# Altium schematic sheet Connector.SchDoc
size A4; Organization: Altium Limited; Address1: L3, 12a Rodborough Rd; Address2: Frenchs Forest; Address3: NSW; Address4: Australia 2086
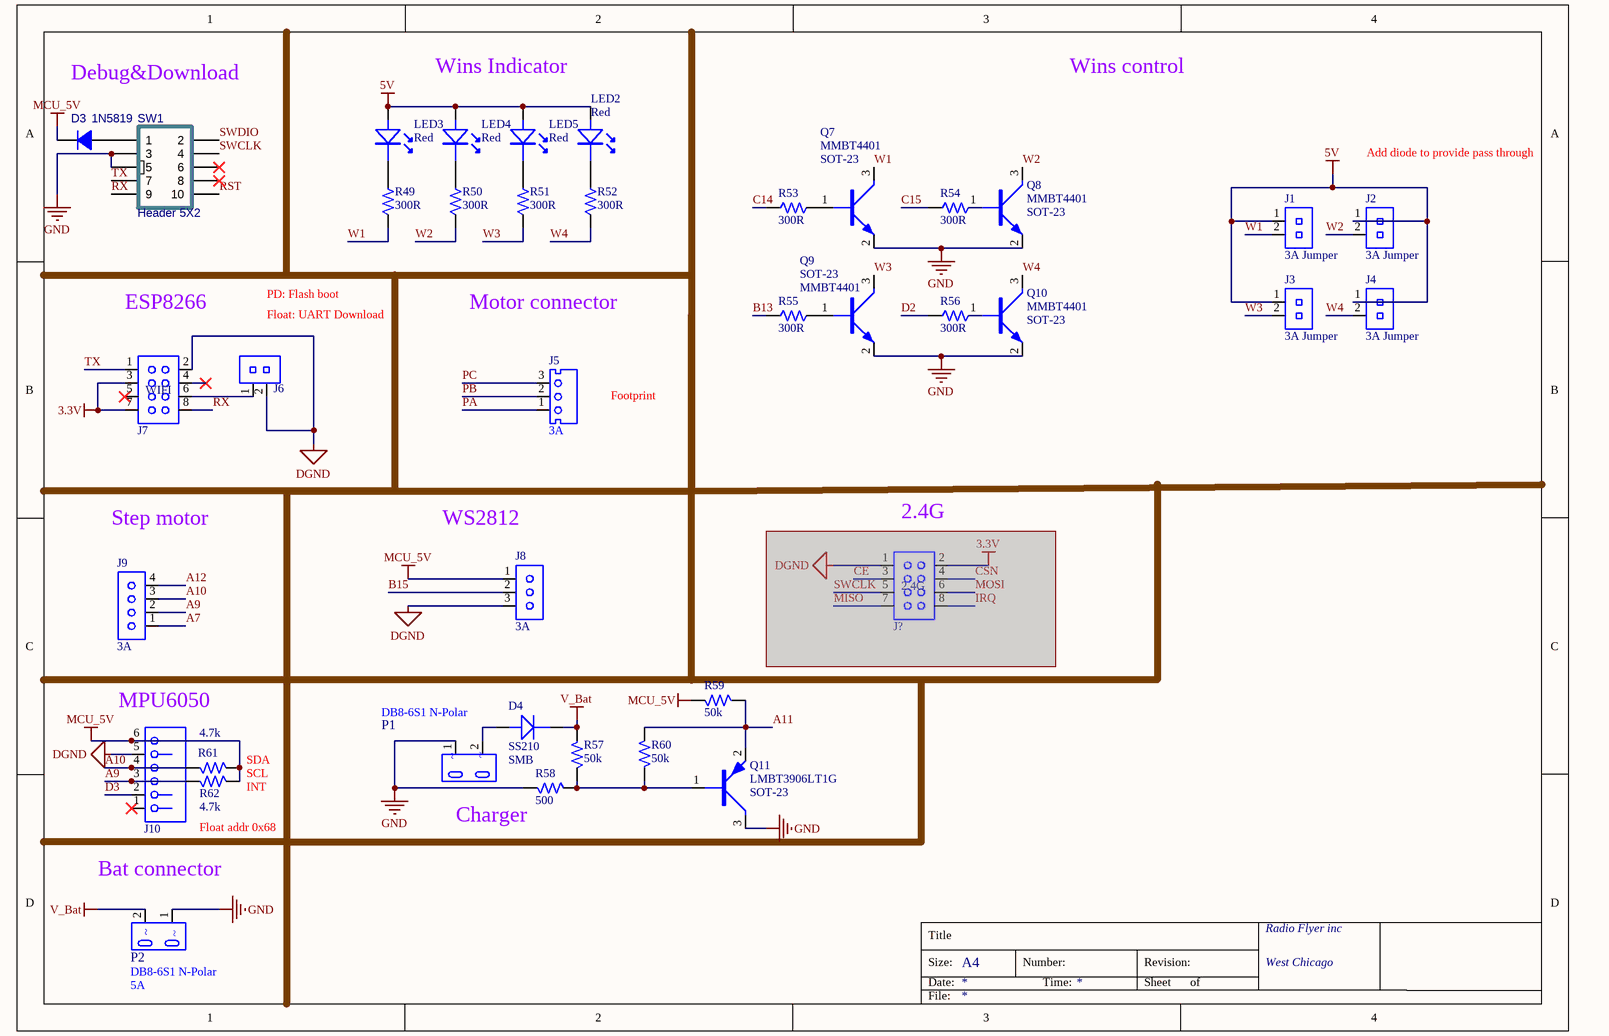
[diagram p0: Connector.SchDoc]

## Parts
D3  1N5819  [SOD-123-L]
D4  RCD102100-0110  [SMB]  (value not drawn)
J1  Current: 3A Jumper  [HOUSING 2P PH=2.54mm Jumper]  (hidden comment: CCH254020-0102)
J2  Current: 3A Jumper  [HOUSING 2P PH=2.54mm Jumper]  (hidden comment: CCH254020-0102)
J3  Current: 3A Jumper  [HOUSING 2P PH=2.54mm Jumper]  (hidden comment: CCH254020-0102)
J4  Current: 3A Jumper  [HOUSING 2P PH=2.54mm Jumper]  (hidden comment: CCH254020-0102)
J5  Current: 3A  [CONN 3P PH=2.5mm B3B-XH-A]  (hidden comment: CCN250000-0103)
J6  CCH254020-0102  [HOUSING 2P PH=2.54mm Jumper]  (value not drawn)
J7  WIFI  [HEAD 8P 2X4 PH=2.54mm 90 H5mm_2.54-2X4AW-10.4]
J8  Current: 3A  [HEAD 3P PH=2.54mm 180]  (hidden comment: CCP254010-0103)
J9  Current: 3A  [HEAD 4P PH=2.54mm 180]  (hidden comment: CCP254260-0104)
J10  T690300121600  [CONN 6P PH=2.5mm RA XHB-6AW-KL]  (value not drawn)
J?  2.4G  [HEAD 8P 2X4 PH=2.54mm 90 H5mm_2.54-2X4AW-10.4]  (masked out: inside a compile mask, not in the netlist)
LED2  Color: Red  [3mm LED-R]  (hidden comment: KED200001-0010)
LED3  Color: Red  [3mm LED-R]  (hidden comment: KED200001-0010)
LED4  Color: Red  [3mm LED-R]  (hidden comment: KED200001-0010)
LED5  Color: Red  [3mm LED-R]  (hidden comment: KED200001-0010)
P1  MFG Part: DB8-6S1 N-Polar  [AC INLET 2P DB8-6S1]  (hidden comment: CJP012009-0050)
P2  MFG Part: DB8-6S1 N-Polar  Current: 5A  [Motor connector]  (hidden comment: CJP012009-0050)
Q7  Package: SOT-23  [SOT23-132-RW]  (hidden comment: MMBT4401)
Q8  Package: SOT-23  [SOT23-132-RW]  (hidden comment: MMBT4401)
Q9  Package: SOT-23  [SOT23-132-RW]  (hidden comment: MMBT4401)
Q10  Package: SOT-23  [SOT23-132-RW]  (hidden comment: MMBT4401)
Q11  MFG Part: LMBT3906LT1G  Package: SOT-23  [SOT23-132-RW]  (hidden comment: RCP003906-0002)
R49  value 300R  [0603]  (hidden comment: T5024421083A9)
R50  value 300R  [0603]  (hidden comment: T5024421083A9)
R51  value 300R  [0603]  (hidden comment: T5024421083A9)
R52  value 300R  [0603]  (hidden comment: T5024421083A9)
R53  value 300R  [0603]  (hidden comment: T5024421083A9)
R54  value 300R  [0603]  (hidden comment: T5024421083A9)
R55  value 300R  [0603]  (hidden comment: T5024421083A9)
R56  value 300R  [0603]  (hidden comment: T5024421083A9)
R57  value 50k  [0603]  (hidden comment: T5024421083A9)
R58  value 500  [0603]  (hidden comment: T5024421083A9)
R59  value 50k  [0603]  (hidden comment: T5024421083A9)
R60  value 50k  [0603]  (hidden comment: T5024421083A9)
R61  value 4.7k  [0603]  (hidden comment: T5024421083A9)
R62  value 4.7k  [0603]  (hidden comment: T5024421083A9)
SW1  Header 5X2  [HDR2X5]

## Nets
3.3V: J7.3 J7.7
5V: J1.1 J2.1 J3.1 J4.1 LED2.1(A) LED3.1(A) LED4.1(A) LED5.1(A)
DGND: J6.2 J7.2 J8.3 J10.5
GND: P1.1 P2.1 Q7.2(E) Q8.2(E) Q9.2(E) Q10.2(E) Q11.3(C) R58.1 SW1.3 SW1.5
MCU_5V: D3.K J8.1 J10.6 R59.2 R61.2 R62.2
V_Bat: D4.2(K) P2.2 R57.1
A7: J9.1
A9: J9.2 J10.3 R62.1
A10: J9.3 J10.4 R61.1
A11: Q11.2(E) R59.1 R60.2
A12: J9.4
B13: R55.1
B15: J8.2
C14: R53.1
C15: R54.1
D2: R56.1
D3: J10.2
PA: J5.1
PB: J5.2
PC: J5.3
RST: SW1.10
RX: J7.8 SW1.9
SWCLK: SW1.4
SWDIO: SW1.2
TX: J7.1 SW1.7
W1: J1.2 Q7.3(C) R49.2
W2: J2.2 Q8.3(C) R50.2
W3: J3.2 Q9.3(C) R51.2
W4: J4.2 Q10.3(C) R52.2
NetD3_A: D3.A SW1.1
NetD4_1: D4.1(A) P1.2
NetJ6_1: J6.1 J7.6
NetLED2_2: LED2.2(K) R52.1
NetLED3_2: LED3.2(K) R49.1
NetLED4_2: LED4.2(K) R50.1
NetLED5_2: LED5.2(K) R51.1
NetQ7_1: Q7.1(B) R53.2
NetQ8_1: Q8.1(B) R54.2
NetQ9_1: Q9.1(B) R55.2
NetQ10_1: Q10.1(B) R56.2
NetQ11_1: Q11.1(B) R57.2 R58.2 R60.1

Not connected (* = marked no-connect by the designer): J7 4* 5*; J10 1*; SW1 6* 8*

## Notes on the sheet
- Debug&Download
- Wins Indicator
- Wins control
- Add diode to provide pass through
- ESP8266
- PD: Flash boot
- Motor connector
- Float: UART Download
- Footprint
- (near J?) 2.4G
- Step motor
- (near J8) WS2812
- (near J10) MPU6050
- SDA
- SCL
- INT
- Float addr 0x68
- (near R58) Charger
- Bat connector
- Title
- Size:
- Date:
- A4
- Number:
- Time:
- Revision:
- Sheet
- of
- Radio Flyer inc
- West Chicago
- File:
- (in symbol AC INLET 2P DB8-6S1 N-Polar) ~

## Library data of the parts
D3 = Diode: 普通二极管 Diode; Imax: 500mA; Published: 8-Jun-2000; Revision: July-2002: Re-released for DXP Platform.; Publisher: Altium Limited; Price(RMB): 0.000
D4 = SS210: SWITC 100V 2A SS210 MIC G; SAP: T572005362246; Vendor Name: 深圳市春明电子有限公司; Vendor Code: 10020343; Type: DIODE; Optional: USD (和572004962246 交易幣別不一樣)帋ISHIDDEN=T|IS|IS|IS|IS|IS|IS; DIP&SMD: SMD; MFG: MIC; Voltage: 100V; Current: 2A; Customer Specific: N/A; MFG Part: SS210; Package: SMB
J1-J4 = HOUSING 2P PH=2.54mm Jumper: HOUSING SIL Jumper 2P 90059-1007 Molex; Value: 2.54mm; SAP: T690300000900; Vendor Name: 深圳市利民丰电子有限公司; Vendor Code: 10020373; DIP&SMD: DIP; MFG: *; MFG Part: *; Type: Connector
J5 = CONN 3P PH=2.5mm B3B-XH-A: GP CONNECTOR B3B-XH-A 3 PIN; Value: 2.5mm; SAP: T690300028900; Vendor Name: 亿源电子有限公司; Vendor Code: 10009989; DIP&SMD: DIP; MFG: *; MFG Part: *; Type: Connector
J6 = HOUSING 2P PH=2.54mm Jumper: HOUSING SIL Jumper 2P 90059-1007 Molex; Value: 2.54mm; SAP: T690300000900; Vendor Name: 深圳市利民丰电子有限公司; Vendor Code: 10020373; DIP&SMD: DIP; Current: 3A Jumper; MFG: *; MFG Part: *; Type: Connector
J7 J? = HEAD 8P 2X4 PH=2.54mm 90 H5mm_2.54-2X4AW-10.4: 2X4P P:2.54MM 90° DIP K; Value: 2.54mm; SAP: T690300110000; MFG: JINJIA; CREATE_NAME: Nathan; MFG Part: 2.54-2X4AW-10.4; Vendor Name: *; Vendor Code: *; Type: Connector; Current: *; CREATE_TIME: 12-Sep-2017; DIP&SMD: DIP
J8 = HEAD 3P PH=2.54mm 180: HEAD PIN 3P P2.54*H11.6MM; Value: 2.54mm; SAP: T690300031100; Vendor Name: 深圳市利民丰电子有限公司; Vendor Code: 10020373; DIP&SMD: DIP; MFG: *; MFG Part: *; Type: Connector
J9 = HEAD 4P PH=2.54mm 180 H11.5mm: HEAD PIN 4P P2.54xH11.5MM; Value: 2.54mm; SAP: T690300023200; Vendor Name: 亿源电子有限公司; Vendor Code: 10009989; DIP&SMD: DIP; MFG: *; MFG Part: *; Type: Connector
J10 = CONN PH 6P PH=2.5mm RA XHB-6AW-KL: CONNECTOR 6PIN P=2.5 WHITE 90 K; Value: 2.5mm; MFG: 金佳电子; CREATE_NAME: Nathan; DIP&SMD: DIP; SAP: T690300121600; MFG Part: XHB-6AW-KL; Vendor Name: *; Vendor Code: *; Type: Connector; Current: *; CREATE_TIME: 27-Sep-2017
LED2-LED5 = FH-F303DNREH: RED LED 2PIN 3 HIGH LIGHT FH-F303DNREH; SAP: T575009720159; Vendor Code: 10020224; Vendor Name: 深圳市富毅华科技有限公司; MFG: 富毅华; Voltage: 2V; DIP&SMD: DIP; MFG Part: FH-F303DNREH; Type: LED
P1 = AC INLET 2P DB8-6S1 N-Polar: AC SOCKET 2P D2.36 2.5A 250V VDE BLACK; SAP: T690300011500; MFG: 金明浩; Vendor Name: 深圳市金明浩电子科技有限公司; Vendor Code: 10010007; DIP&SMD: DIP; Current: 5A; Value: *; Type: Connector
P2 = AC INLET 2P DB8-6S1 N-Polar: AC SOCKET 2P D2.36 2.5A 250V VDE BLACK; SAP: T690300011500; MFG: 金明浩; Vendor Name: 深圳市金明浩电子科技有限公司; Vendor Code: 10010007; DIP&SMD: DIP; Value: *; Type: Connector
Q7-Q10 = MMBT4401: NPN 40V MMBT4401 SOT23 FAIRCH K; MFG: FAIRCHILD; DIP&SMD: SMD; CREATE_NAME: Nathan; SAP: *; Vendor Code: *; Vendor Name: *; Power: *; Voltage: *; Type: NPN; Customer Specific: N/A; CREATE_TIME: 29-Dec-2020; MFG Part: MMBT4401
Q11 = LMBT3906LT1G_LRC: PNP 40V LMBT3906LT1G SOT23 LRC L; SAP: T582002540437; Vendor Code: 10020356; Vendor Name: 汉秥（香港）电子有限公司; DIP&SMD: SMD; MFG: LRC; Power: *; Voltage: *; Type: PNP; Customer Specific: N/A
R49-R62 = RES0201 1/20W 1% 4.42K OHM_WALSIN: CHIP 4.42K OHM 200PPM +-1% 0201 WALS L; MFG Part: WR02X4421FAL; Power: 1/20W; MFG: WALSIN (華新); TOL: 1%; CREATE_NAME: Nathan; DIP&SMD: SMD; Vendor Code: *; SAP: T5024421083A9; Vendor Name: *; Type: Resistor; PACKAGE: 0603; CREATE_TIME: 23-July-2019; Customer Specific: N/A
SW1 = Header 5X2: Header, 5-Pin, Dual row; LatestRevisionDate: 17-Jul-2002; LatestRevisionNote: Re-released for DXP Platform.; Publisher: Altium Limited; Price(RMB): 0.00